# EAGLE design fully_diff_1.7 (EAGLE 7.6.0)
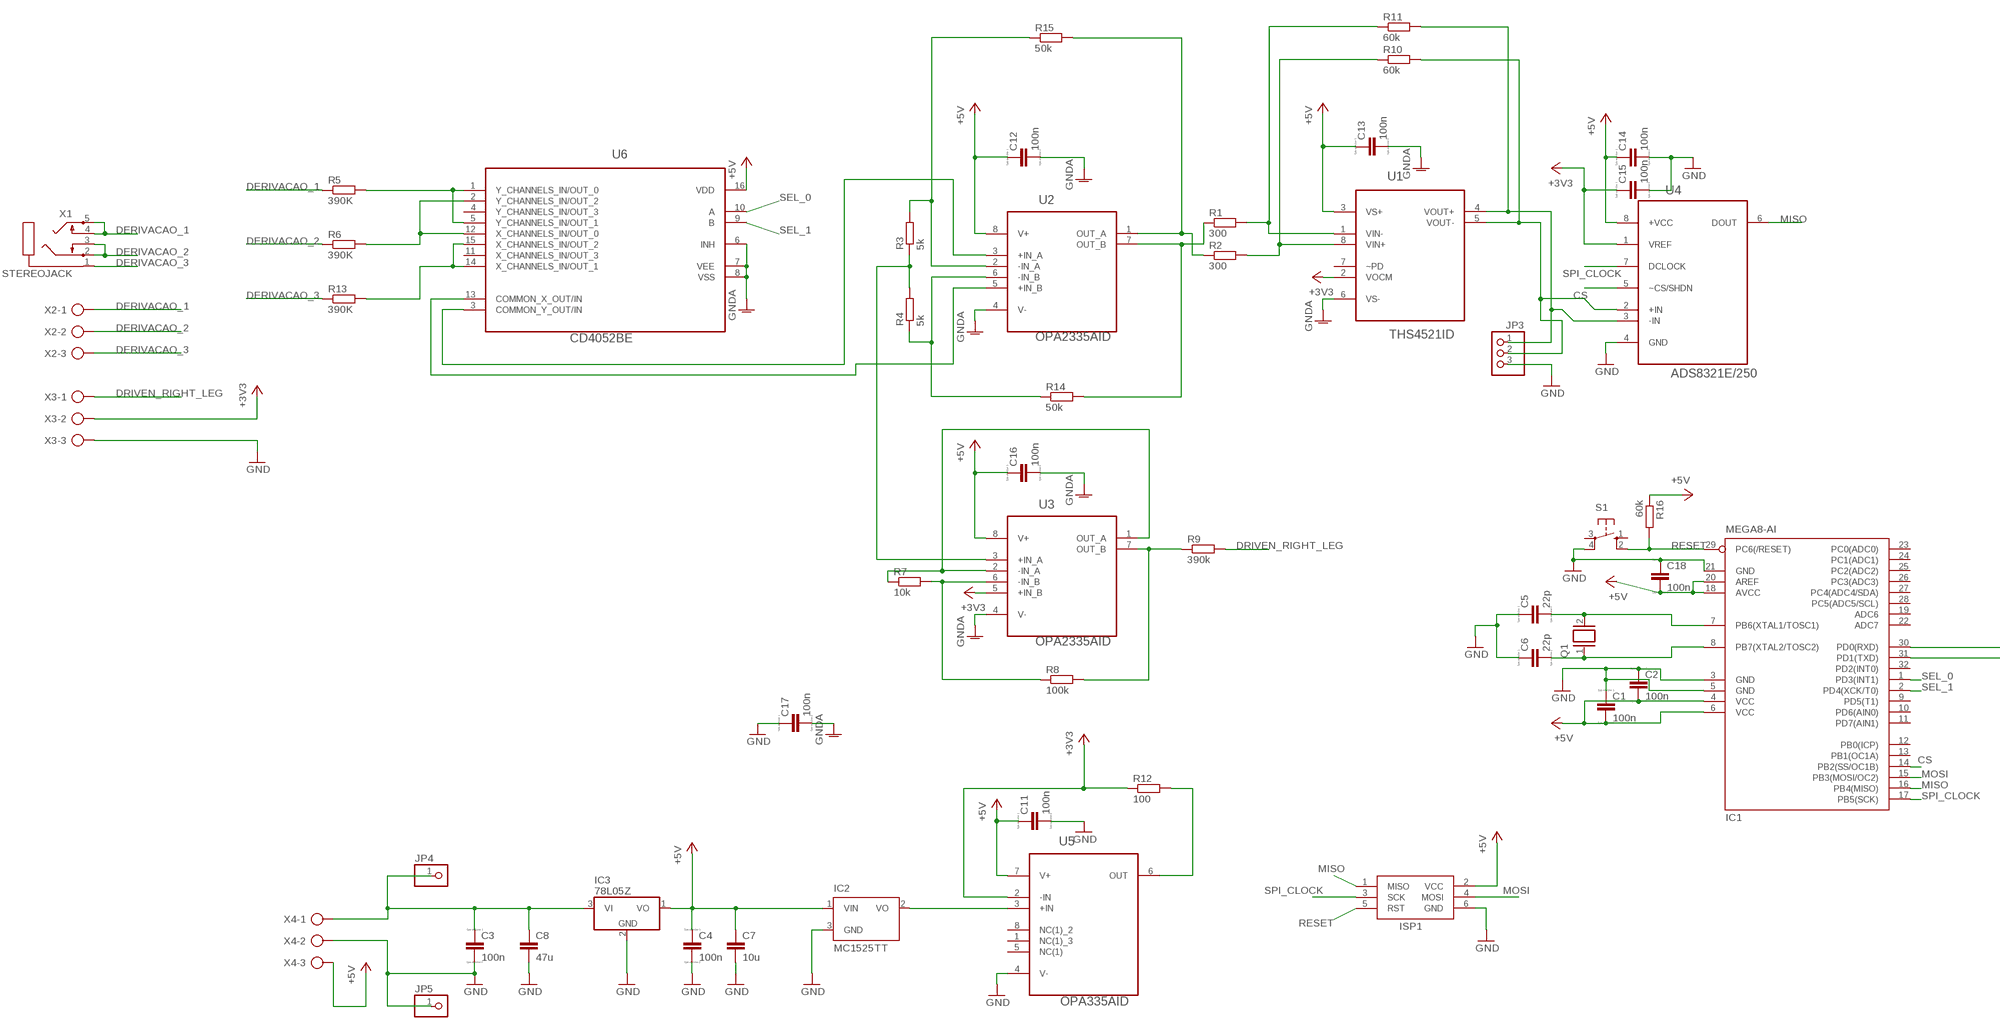
[diagram p0: schematic, sheet 1, part 1 of 2]
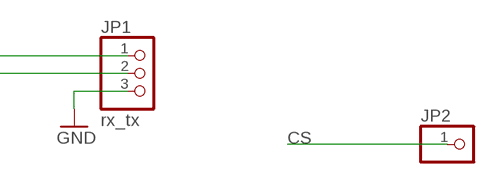
[diagram p1: schematic, sheet 1, part 2 of 2]

## Parts
C1  100n  CC1206  [C1206]
C2  100n  CC1206  [C1206]
C3  100n  CC1206  [C1206]
C4  100n  CC1206  [C1206]
C5  22p  CC1206  [C1206]
C6  22p  CC1206  [C1206]
C7  10u  C-EU025-030X050  [C025-030X050]
C8  47u  C-EU025-030X050  [C025-030X050]
C11  100n  CC1206  [C1206]
C12  100n  CC1206  [C1206]
C13  100n  CC1206  [C1206]
C14  100n  CC1206  [C1206]
C15  100n  CC1206  [C1206]
C16  100n  CC1206  [C1206]
C17  100n  CC1206  [C1206]
C18  100n  CC1206  [C1206]
IC1  MEGA8-AI  [TQFP32-08]
IC2  MC1525TT  [SOT23]
IC3  78L05Z  [TO92]
ISP1  AVRISP-6  [AVRISP]
JP1  rx_tx  PINHD-1X3  [1X03]
JP2  PINHD-1X1  [1X01]
JP3  PINHD-1X3  [1X03]
JP4  PINHD-1X1  [1X01]
JP5  PINHD-1X1  [1X01]
Q1  XTAL/S  [QS]
R1  300  R-EU_R1206  [R1206]
R2  300  R-EU_R1206  [R1206]
R3  5k  R-EU_R1206  [R1206]
R4  5k  R-EU_R1206  [R1206]
R5  390K  R-EU_R1206  [R1206]
R6  390K  R-EU_R1206  [R1206]
R7  10k  R-EU_R1206  [R1206]
R8  100k  R-EU_R1206  [R1206]
R9  390k  R-EU_R1206  [R1206]
R10  60k  R-EU_R1206  [R1206]
R11  60k  R-EU_R1206  [R1206]
R12  100  R-EU_R1206  [R1206]
R13  390K  R-EU_R1206  [R1206]
R14  50k  R-EU_R1206  [R1206]
R15  50k  R-EU_R1206  [R1206]
R16  60k  R-EU_R1206  [R1206]
S1  10-XX  [B3F-10XX]
U1  THS4521ID  [SOIC127P600X175-8N]
U2  OPA2335AID  [SOIC127P600X175-8N]
U3  OPA2335AID  [SOIC127P600X175-8N]
U4  ADS8321E/250  [SOP65P490X110-8N]
U5  OPA335AID  [SOIC127P600X175-8N]
U6  CD4052BE  [DIP254P762X508-16]
X1  STEREOJACK  [STX3100]
X2  AK300/3  [AK300/3]
X3  AK300/3  [AK300/3]
X4  AK300/3  [AK300/3]

## Nets
+3V3: C15.1 R12.1 U1.2(VOCM) U3.5(+IN_B) U4.1(VREF) U5.2(-IN) X3.2
+5V: C1.2 C2.2 C4.1 C7.1 C11.1 C12.1 C13.1 C14.1 C16.1 C18.2 IC1.4(VCC) IC1.6(VCC) IC1.18(AVCC) IC1.20(AREF) IC2.1(VIN) IC3.1(VO) ISP1.2(VCC) R16.1 U1.3(VS+) U2.8(V+) U3.8(V+) U4.8(+VCC) U5.7(V+) U6.16(VDD) X4.3
CS: IC1.14(PB2(SS/OC1B)) JP2.1 U4.5(~CS/SHDN)
DERIVACAO_1: R5.1 X1.4 X1.5 X2.1
DERIVACAO_2: R6.1 X1.2 X1.3 X2.2
DERIVACAO_3: R13.1 X1.1 X2.3
DRIVEN_RIGHT_LEG: R9.2 X3.1
GND: C1.1 C2.1 C3.2 C4.2 C5.1 C6.1 C7.2 C8.2 C11.2 C14.2 C15.2 C17.1 C18.1 IC1.3(GND) IC1.5(GND) IC1.21(GND) IC2.3(GND) IC3.2(GND) ISP1.6(GND) JP1.3 JP3.3 JP5.1 S1.4(P1) U4.4(GND) U5.4(V-) X3.3 X4.2
GNDA: C12.2 C13.2 C16.2 C17.2 U1.6(VS-) U2.4(V-) U3.4(V-) U6.6(INH) U6.7(VEE) U6.8(VSS)
MISO: IC1.16(PB4(MISO)) ISP1.1(MISO) U4.6(DOUT)
MOSI: IC1.15(PB3(MOSI/OC2)) ISP1.4(MOSI)
N$1: R2.2 R10.1 U1.8(VIN+)
N$2: R1.2 R11.1 U1.1(VIN-)
N$3: R1.1 R14.2 U2.7(OUT_B)
N$4: R2.1 R15.2 U2.1(OUT_A)
N$5: R3.2 R15.1 U2.2(-IN_A)
N$6: R4.1 R14.1 U2.6(-IN_B)
N$7: R3.1 R4.2 U3.3(+IN_A)
N$8: R6.2 U6.2(Y_CHANNELS_IN/OUT_2) U6.12(X_CHANNELS_IN/OUT_0)
N$9: R7.1 U3.1(OUT_A) U3.2(-IN_A)
N$10: R8.2 R9.1 U3.7(OUT_B)
N$11: R7.2 R8.1 U3.6(-IN_B)
N$13: JP3.2 R10.2 U1.5(VOUT-) U4.2(+IN)
N$14: JP3.1 R11.2 U1.4(VOUT+) U4.3(-IN)
N$15: C5.2 IC1.7(PB6(XTAL1/TOSC1)) Q1.2
N$16: U2.5(+IN_B) U6.13(COMMON_X_OUT/IN)
N$17: U2.3(+IN_A) U6.3(COMMON_Y_OUT/IN)
N$18: IC2.2(VO) U5.3(+IN)
N$19: C6.2 IC1.8(PB7(XTAL2/TOSC2)) Q1.1
N$20: R5.2 U6.1(Y_CHANNELS_IN/OUT_0) U6.5(Y_CHANNELS_IN/OUT_1)
N$21: R12.2 U5.6(OUT)
N$23: IC1.30(PD0(RXD)) JP1.1
N$24: R13.2 U6.14(X_CHANNELS_IN/OUT_1) U6.15(X_CHANNELS_IN/OUT_2)
N$25: C3.1 C8.1 IC3.3(VI) JP4.1 X4.1
N$26: IC1.31(PD1(TXD)) JP1.2
RESET: IC1.29(PC6(/RESET)) ISP1.5(RST) R16.2 S1.2(S1)
SEL_0: IC1.1(PD3(INT1)) U6.10(A)
SEL_1: IC1.2(PD4(XCK/T0)) U6.9(B)
SPI_CLOCK: IC1.17(PB5(SCK)) ISP1.3(SCK) U4.7(DCLOCK)
Unconnected: IC1.9(PD5(T1)) IC1.10(PD6(AIN0)) IC1.11(PD7(AIN1)) IC1.12(PB0(ICP)) IC1.13(PB1(OC1A)) IC1.19(ADC6) IC1.22(ADC7) IC1.23(PC0(ADC0)) IC1.24(PC1(ADC1)) IC1.25(PC2(ADC2)) IC1.26(PC3(ADC3)) IC1.27(PC4(ADC4/SDA)) IC1.28(PC5(ADC5/SCL)) IC1.32(PD2(INT0)) S1.1(S) S1.3(P) U1.7(~PD) U5.1(NC(1)_3) U5.5(NC(1)) U5.8(NC(1)_2) U6.4(Y_CHANNELS_IN/OUT_3) U6.11(X_CHANNELS_IN/OUT_3)

## Library data of the parts
C1-C6 C11-C18 = eagle-ltspice:C: CAPACITOR, European symbol; SPICEMODEL: NONE; SPICEPREFIX: C
C7 C8 = rcl:C-EU: CAPACITOR, European symbol
IC1 = atmel:MEGA8: MICROCONTROLLER 8 Kbytes FLASH, 1 kbytes SRAM, 512 bytes EEPROM, USART, 6-channel 10 bit ADC, 2-channel 8 bit ADC Pin compatible with Atmega48, ATMega88, ATMega168 Source: avr.lbr; MPN: ATMEGA8-16AU; OC_FARNELL: 9171371; OC_NEWARK: 73M8863
IC2 = microchip:MC15*: 2.5V and 4.096V Voltage References Source: http://www.microchip.com .. 21653b.pdf; OC_FARNELL: unknown; OC_NEWARK: unknown
IC3 = linear:78*: Positive VOLTAGE REGULATOR Source: http://cache.national.com/ds/LM/LM78L05.pdf http://www.fairchildsemi.com/ds/LM/LM7805.pdf
ISP1 = adafruit:AVRISP: AVR ISP HEADER Standard 6 pin header for AVR programming
JP1 JP3 = adafruit:PINHD-1X3: PIN HEADER
JP2 JP4 JP5 = adafruit:PINHD-1X1: Pin header 1x1 for 0.1" spacing With round pins
Q1 = special:XTAL/S: CRYSTAL
R1-R16 = resistor:R-EU_: RESISTOR, European symbol
S1 = switch-omron:10-XX: OMRON SWITCH; MPN: B3F-1000; OC_FARNELL: 176432; OC_NEWARK: 36M3542
U1 = Texas Instruments_By_element14_Batch_1:THS4521ID: VERY LOW POWER, NEGATIVE RAIL INPUT, RAIL-TO-RAIL OUTPUT FULLY DIFFERENTIAL AMPLIFIER; MPN: THS4521ID; OC_FARNELL: 1755707; OC_NEWARK: 45P2938; PACKAGE: SOIC-8; SUPPLIER: Texas Instruments
U2 U3 = Texas Instruments_By_element14_Batch_1:OPA2335AID: CMOS OPERATIONAL AMPLIFIERS; MPN: OPA2335AID; OC_FARNELL: 1470388; OC_NEWARK: 75C4669; PACKAGE: SOIC-8; SUPPLIER: Texas Instruments
U4 = Texas Instruments_By_element14_Batch_1:ADS8321E/250: 16-Bit, High Speed, MicroPower Sampling ANALOG-TO-DIGITAL CONVERTER; MPN: ADS8321E/250; OC_FARNELL: 1470332; OC_NEWARK: 35C1583; PACKAGE: MSOP-8; SUPPLIER: Texas Instruments
U5 = Texas Instruments_By_element14_Batch_1:OPA335AID: CMOS OPERATIONAL AMPLIFIERS; MPN: OPA335AID; OC_FARNELL: 1212296; OC_NEWARK: 75C4833; PACKAGE: SOIC-8; SUPPLIER: Texas Instruments
U6 = Texas Instruments_By_element14_Batch_1:CD4052BE: The CD4052B is a differential 4-Channel multiplexer having two binary control inputs.; MPN: CD4052BE; OC_FARNELL: 9589538; OC_NEWARK: 60K5120; PACKAGE: PDIP-16; SUPPLIER: Texas Instruments
X1 = adafruit:STEREOJACK: MIC/HEADPHONE JACK Stereo jack with two switches. Kycon STX3100, CUI SJ1-3555NG and/or 4UCon 05544
X2-X4 = con-ptr500:AK300/3: CONNECTOR; OC_FARNELL: unknown; OC_NEWARK: unknown

## Board
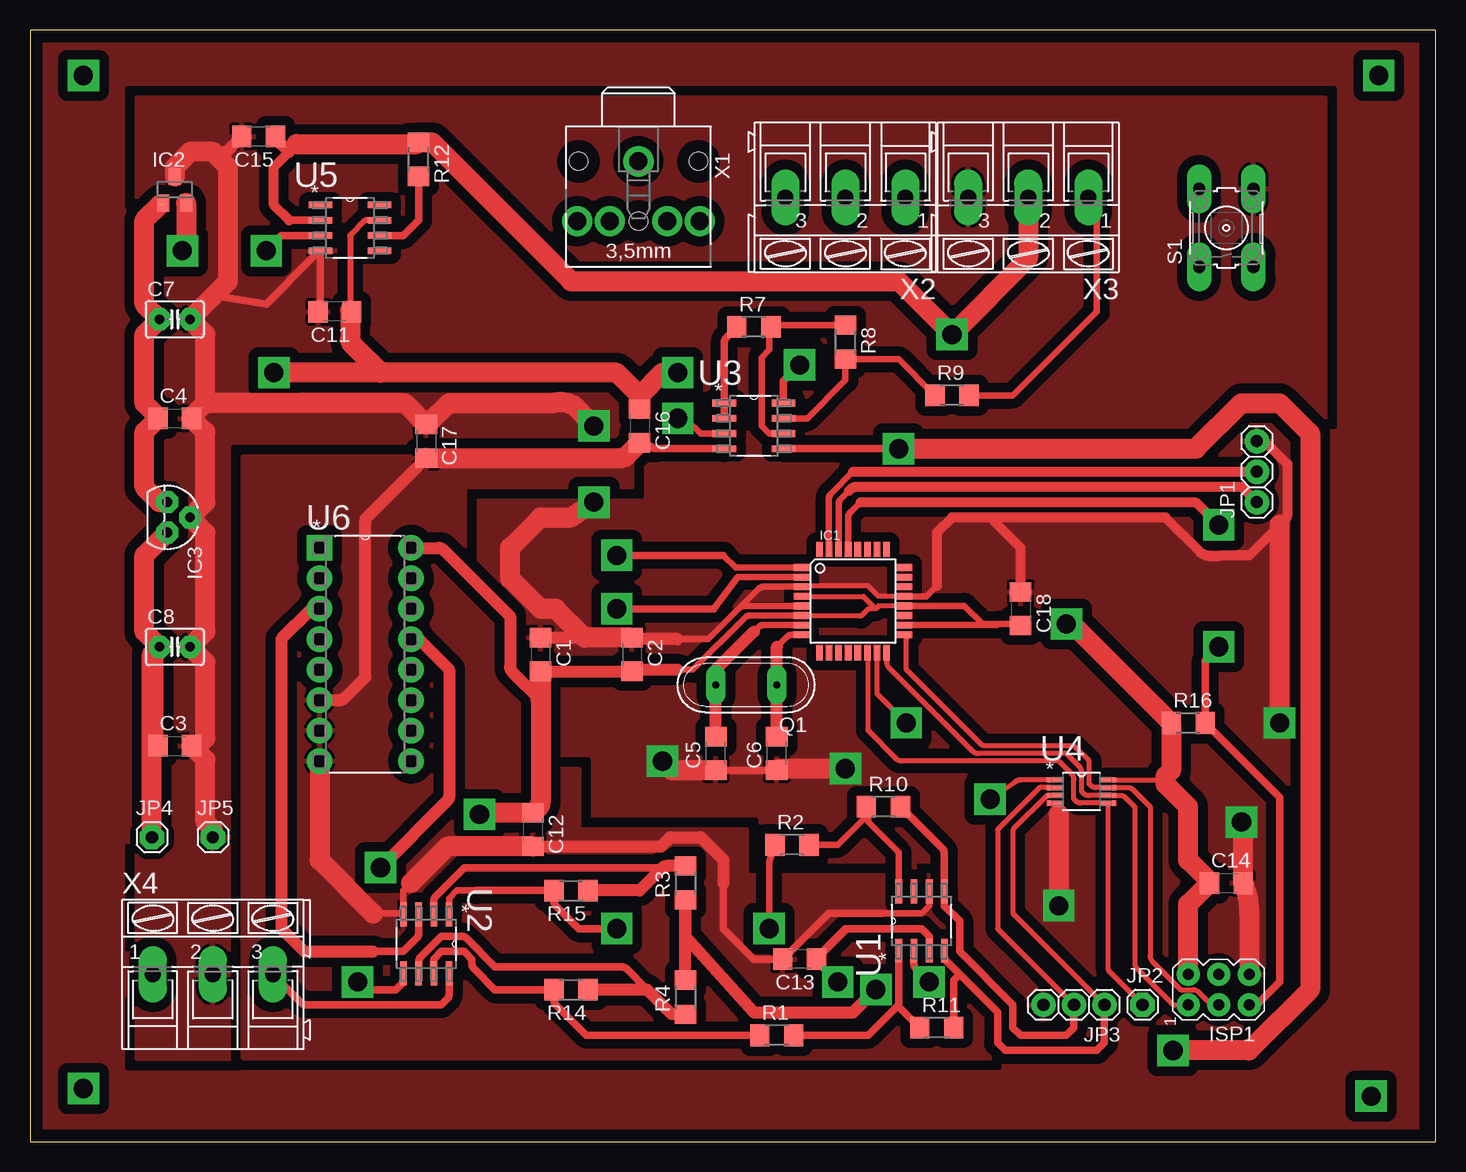
[diagram p2: board, top side]
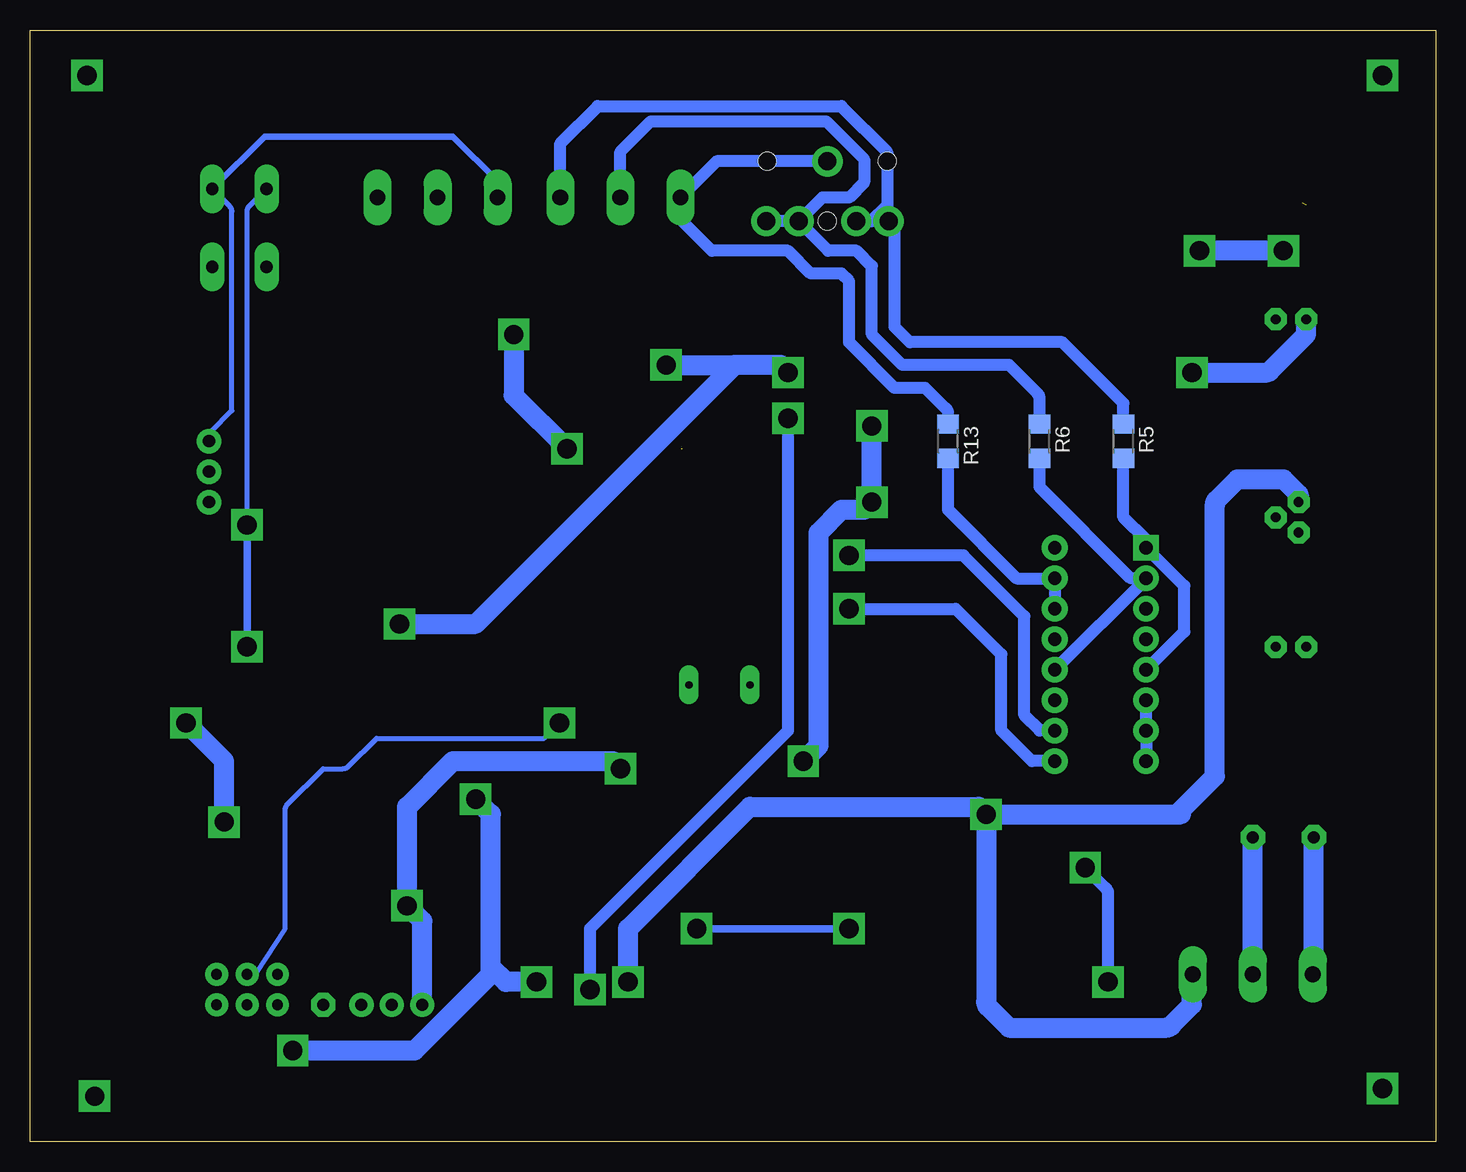
[diagram p3: board, bottom side, seen from below]

Size 117.14 x 92.7 mm. Coordinates in mm from the lower left corner, seen from the top.
Outline: 0,0 117.14,0 117.14,92.7 0,92.7 0,0
Copper layers (1*16): Top 0.035mm / dielectric 1.5mm / Bottom 0.035mm
Design rules "default *": minimum track width 10mil, minimum drill 24mil, track to track 8mil, track to pad 8mil, pad to pad 8mil, via to via 8mil, smd to smd 8mil, copper to edge 40mil, drill to drill 8mil, minimum pad ring 20mil, minimum via ring 20mil, stop-mask expansion 2mil, vias tented up to drill 0mil, thermal gap 10mil

### Footprints (pad centres in the part's own frame; a part is rotated, then mirrored left to right if it is on the bottom)
C1206 = smd 1.6 x 1.8: 1 -1.4,0; 2 1.4,0
C025-030X050 = drill 0.813 octagon: 1 -1.27,0; 2 1.27,0
TQFP32-08 = smd 1.27 x 0.559: 1 -4.293,2.8; 2 -4.293,2; 3 -4.293,1.2; 4 -4.293,0.4; 5 -4.293,-0.4; 6 -4.293,-1.2; 7 -4.293,-2; 8 -4.293,-2.8; 17 4.293,-2.8; 18 4.293,-2; 19 4.293,-1.2; 20 4.293,-0.4; 21 4.293,0.4; 22 4.293,1.2; 23 4.293,2; 24 4.293,2.8 | smd 0.559 x 1.27: 9 -2.8,-4.293; 10 -2,-4.293; 11 -1.2,-4.293; 12 -0.4,-4.293; 13 0.4,-4.293; 14 1.2,-4.293; 15 2,-4.293; 16 2.8,-4.293; 25 2.8,4.293; 26 2,4.293; 27 1.2,4.293; 28 0.4,4.293; 29 -0.4,4.293; 30 -1.2,4.293; 31 -2,4.293; 32 -2.8,4.293
SOT23 = smd 1 x 1.4: 1 -0.95,-1.1; 2 0.95,-1.1; 3 0,1.1
TO92 = drill 0.813 octagon: 1 -1.27,0; 2 0,1.905; 3 1.27,0
AVRISP = drill 0.9 pad 1.626: 1 -1.27,2.54; 2 1.27,2.54; 3 -1.27,0; 4 1.27,0; 5 -1.27,-2.54; 6 1.27,-2.54
1X03 = drill 1.016: 1 -2.54,0; 2 0,0; 3 2.54,0
1X01 = drill 1.016 pad 1.93 octagon: 1 0,0
QS = drill 0.61 long: 1 -2.54,0; 2 2.54,0
R1206 = smd 1.6 x 1.803: 1 -1.422,0; 2 1.422,0
B3F-10XX = drill 1.016 long: 1 -3.251,2.261; 2 3.251,2.261; 3 -3.251,-2.261; 4 3.251,-2.261
SOIC127P600X175-8N = smd 1.981 x 0.559: 1 -2.464,1.905; 2 -2.464,0.635; 3 -2.464,-0.635; 4 -2.464,-1.905; 5 2.464,-1.905; 6 2.464,-0.635; 7 2.464,0.635; 8 2.464,1.905
SOP65P490X110-8N = smd 1.422 x 0.432: 1 -2.184,0.965; 2 -2.184,0.33; 3 -2.184,-0.33; 4 -2.184,-0.965; 5 2.184,-0.965; 6 2.184,-0.33; 7 2.184,0.33; 8 2.184,0.965
DIP254P762X508-16 = drill 1.118 square: 1 -7.62,17.78 | drill 1.118: 2 -7.62,15.24; 3 -7.62,12.7; 4 -7.62,10.16; 5 -7.62,7.62; 6 -7.62,5.08; 7 -7.62,2.54; 8 -7.62,0; 9 0,0; 10 0,2.54; 11 0,5.08; 12 0,7.62; 13 0,10.16; 14 0,12.7; 15 0,15.24; 16 0,17.78
STX3100 = drill 1.5 pad 2.54: 1 2.7,-0.1 | drill 1.5: 2 7.7,5; 3 7.7,2.3; 4 7.7,-2.5; 5 7.7,-5.2 | hole 1.5: 2.7,4.9; 2.7,-5.1; 7.7,-0.1
AK300/3 = drill 1.321 long: 1 -5.004,0; 2 0,0; 3 5.004,0

### Placement (x,y rotation side)
C1  42.55,40.64 270 top
C2  50.16,40.64 270 top
C3  12.06,33.02 0 top
C4  12.06,60.32 0 top
C5  57.15,32.38 90 top
C6  62.23,32.38 90 top
C7  12.06,68.58 0 top
C8  12.06,41.27 0 top
C11  25.4,69.22 180 top
C12  41.91,26.04 270 top
C13  64.13,15.24 180 top
C14  99.69,21.59 0 top
C15  19.05,83.82 180 top
C16  50.8,59.69 270 top
C17  33.02,58.42 270 top
C18  82.55,44.45 270 top
IC1  68.58,45.09 0 top
IC2  12.06,79.38 0 top
IC3  11.43,52.07 270 top
ISP1  99.06,12.7 90 top
JP1  102.23,55.88 90 top
JP2  92.71,11.43 0 top
JP3  86.99,11.43 180 top
JP4  10.16,25.4 0 top
JP5  15.24,25.4 0 top
Q1  59.69,38.1 180 top
R1  62.23,8.89 0 top
R2  63.5,24.77 0 top
R3  54.61,21.59 90 top
R4  54.61,12.07 90 top
R5  26.03,58.42 270 bottom
R6  33.02,58.42 270 bottom
R7  60.33,67.95 0 top
R8  67.94,66.67 270 top
R9  76.83,62.23 0 top
R10  71.12,27.94 0 top
R11  75.56,9.53 0 top
R12  32.38,81.92 270 top
R13  40.64,58.42 270 bottom
R14  45.09,12.7 180 top
R15  45.09,20.96 180 top
R16  96.52,34.92 0 top
S1  99.69,76.2 90 top
U1  74.29,18.41 90 top
U2  33.02,16.51 270 top
U3  60.33,59.69 0 top
U4  87.63,29.21 0 top
U5  26.67,76.2 0 top
U6  31.75,31.75 0 top
X1  50.8,84.45 270 top
X2  67.94,78.74 180 top
X3  83.18,78.74 180 top
X4  15.24,13.97 0 top

### Tracks (layer width: path | path; a pad name or v marks a point on that pad's centre or on a via)
+3V3  (via drill 1.6)  (1 unrouted)
  Top 0.406: U4.1 82.51,30.18 arc45 82.06,29.99 v80.01,28.57
  Top 0.61: 21.59,76.84 U5.2 | U1.2 73.66,14.87 arc45 73.85,14.42 v74.93,13.34 | 31.6,83.19 R12.1 | 62.87,57.78 v72.39,57.78
  Top 0.813: 21.59,76.84 20.32,78.11 20.32,81.28 21.59,82.55 22.23,83.19
  Top 1.016: C15.1 20.45,83.69 21.59,82.55
  Top 1.676: v72.39,57.78 97.16,57.78 100.96,61.59 104.14,61.59 106.68,59.05 106.68,12.7 101.6,7.62 v95.25,7.62 | 22.23,83.19 32.23,83.19 R12.1 33.5,83.34 45.09,71.76 72.39,71.76 v76.83,67.31 83.18,73.66 X3.2
  Bottom 0.61: 77.66,13.52 78.74,14.61 78.74,27.04 arc-45 78.93,27.49 v80.01,28.57
  Bottom 1.676: v95.25,7.62 85.09,7.62 78.74,13.97 78.74,14.61 | 78.74,14.61 78.74,27.3 v80.01,28.57 | v74.93,13.34 77.47,13.34 78.74,14.61 | v76.83,67.31 76.83,62.23 v72.39,57.78
+5V  (via drill 1.6, 1.6 pad 0.25)  (1 unrouted)
  Top 0.406: C1.2 C2.2 50.3,39.37 53.98,39.37 | IC1.4 69.45,45.48 70.48,44.45 | IC1.6 69.14,43.88 69.22,43.81 69.85,44.45 70.48,44.45 | IC1.20 70.72,44.68 70.48,44.45 | U4.8 94.31,30.18 94.61,30.48
  Top 0.508: U5.7 27.94,76.84 26.67,75.56 26.67,69.34 C11.1
  Top 0.559: IC1.6 60.02,43.88 arc45 59.57,43.7 55.25,39.37 53.98,39.37 | 74.29,17.78 70.48,17.78 | 86.49,43.05 v86.36,43.18 | IC1.20 77.87,44.68 79.38,43.18 80.64,43.18 | 80.64,43.18 82.42,43.18 C18.2 | IC1.18 80.55,43.09 80.64,43.18
  Top 0.61: U2.8 34.92,12.33 arc-45 34.74,11.88 34.29,11.43 23.05,11.43 arc-45 22.6,11.62 X4.3 | 82.52,43.09 C18.2 | U3.8 62.79,63.42 v64.13,64.77 | v53.98,64.14 53.98,63.63 | 70.48,17.78 68.08,17.78 C13.1 | U1.3 74.93,17.14 74.29,17.78 67.94,17.78 65.41,15.24 v67.31,13.34
  Top 1.016: C1.2 50.04,39.24 50.16,39.37 53.98,39.37 | U6.16 34.03,49.53 arc-45 34.48,49.34 40.01,43.81 40.01,39.63 arc45 40.19,39.18 42.55,36.83
  Top 1.676: IC3.1 10.79,53.34 9.52,54.61 9.52,59.18 C4.1 10.66,60.45 9.52,61.59 9.52,67.31 C7.1 9.52,69.85 9.52,76.84 10.79,78.11 | C1.2 42.55,36.83 42.55,28.33 arc-45 42.36,27.88 C12.1 38.49,27.44 arc45 38.04,27.25 v37.46,27.3 | 29.21,64.14 48.9,64.14 50.61,62.42 arc-45 50.8,61.97 C16.1 50.8,62.23 52.7,64.14 v53.98,64.14 | 29.21,64.14 v20.32,64.14 | 26.67,69.34 26.67,66.94 arc45 26.86,66.49 29.21,64.14 | ISP1.2 96.52,19.82 C14.1 98.29,21.72 96.52,23.5 96.52,27.94 94.61,29.85 94.61,30.48 95.1,30.96 R16.1 86.97,43.05 86.49,43.05
  Bottom 0.61: 54.61,64.77 v53.98,64.14
  Bottom 1.676: v37.46,27.3 21.22,27.3 arc-45 21.4,27.49 18.41,30.48 18.41,53.08 arc45 18.23,53.53 16.51,55.24 12.7,55.24 11.43,53.97 IC3.1 | v37.46,27.3 37.46,11.69 arc-45 37.28,11.24 35.56,9.53 22.49,9.53 arc-45 22.04,9.71 20.32,11.43 20.32,13.79 arc45 X4.3 | v20.32,64.14 14.23,64.14 arc-45 13.78,64.32 10.79,67.31 C7.1 | v67.31,13.34 67.31,17.78 57.15,27.94 38.1,27.94 v37.46,27.3 | v86.36,43.18 80.01,43.18 58.42,64.77 | 54.61,64.77 58.42,64.77 | v64.13,64.77 58.42,64.77
CS
  Top 0.406: JP2.1 90,14.14 arc-45 89.81,14.59 U4.5 87.59,28.25 arc-45 87.14,28.43 86.99,28.57 86.99,30.22 arc45 86.81,30.67 85.72,31.75 72.65,31.75 arc-45 72.2,31.94 69.85,34.29 69.85,40.62 | 69.85,40.62 arc45 IC1.14 arc-45 69.85,40.62
DERIVACAO_1
  Bottom 1.016: X2.1 72.95,83.26 69.85,86.36 49.53,86.36 45.72,82.55 45.72,78.11 | 45.72,78.11 45.72,76.88 X1.5 45.09,76.24 45.09,67.95 43.82,66.67 31.12,66.67 26.03,61.59 R5.1 | X1.4 47.07,76.76 45.72,78.11
DERIVACAO_2
  Bottom 1.016: X2.2 67.94,82.55 65.41,85.09 50.8,85.09 47.62,81.92 47.62,80.01 48.9,78.74 51.12,78.74 X1.3 | X1.3 X1.2 | X1.3 50.64,74.3 48.26,74.3 46.99,73.03 46.99,67.31 44.45,64.77 35.56,64.77 33.21,62.42 arc45 33.02,61.97 R6.1
DERIVACAO_3
  Bottom 1.016: X1.1 59.93,81.76 X2.3 62.87,78.66 62.87,76.84 60.33,74.3 53.98,74.3 52.07,72.39 49.53,72.39 48.9,71.76 48.9,66.67 45.09,62.86 42.55,62.86 40.83,61.15 arc45 40.64,60.7 R13.1
DRIVEN_RIGHT_LEG
  Top 0.559: R9.2 81.91,62.23 88.9,69.22 88.9,78.03 X3.1
GND  (via drill 1.6)
  Top 0.406: 50.04,42.04 C2.1 50.3,41.91 | IC1.21 70.72,45.48 69.85,46.35 64.36,46.35 IC1.3 | 85.72,27.3 85.72,27.96 U4.4
  Top 0.508: 15.88,70.48 15.88,71.12 16.19,71.44
  Top 0.559: 53.98,41.91 56.52,41.91 59.1,44.5 | IC1.5 59.55,44.68 arc45 59.1,44.5 | IC1.3 61.15,46.28 arc45 60.7,46.1 59.1,44.5 | IC1.21 74.69,45.48 75.56,46.35
  Top 0.61: C11.2 24.21,69.64 U5.4 23.49,73.66 19.69,69.85 15.88,70.48 | C6.1 C5.1
  Top 0.813: JP1.3 102.61,58.42 arc-45 103.06,58.23 104.77,56.52 104.77,52.33 arc-45 104.59,51.88 104.14,51.43 101.6,48.89 99.32,48.89 arc-45 97.6,49.08 94.61,52.07 80.01,52.07 | C18.1 82.55,49.53 80.01,52.07 | 80.01,52.07 76.83,52.07 75.56,50.8 75.56,46.35
  Top 1.016: C1.1 50.04,42.04 50.16,41.91 | 53.98,41.91 50.48,41.91 arc-45 C2.1 | 15.24,82.55 16.38,82.55 C15.2
  Top 1.676: JP5.1 15.24,26.04 14.61,26.67 14.61,31.88 C3.2 13.97,33.02 14.61,33.66 14.61,40 C8.2 14.61,42.54 14.61,50.8 IC3.2 14.61,53.34 14.61,59.18 C4.2 13.46,60.45 14.42,61.41 | 14.42,61.41 14.61,61.59 14.61,67.31 C7.2 16.19,71.44 16.51,71.76 16.51,81.28 15.24,82.55 13.34,82.55 12.06,81.28 IC2.3 | 14.42,61.41 arc-45 14.87,61.59 30.98,61.59 arc-45 31.43,61.41 C17.1 arc45 33.24,59.91 34.92,61.59 43.55,61.59 arc-45 45.27,61.41 v46.99,59.69 | 50.04,42.04 46.23,42.04 43.82,44.45 42.55,44.45 40.01,46.99 40.01,49.53 42.55,52.07 45.09,52.07 v46.99,53.34 | ISP1.6 101.6,19.05 101.47,20.45 C14.2 101.09,26.54 v100.96,26.67 | v104.14,34.92 104.14,51.43 | C5.1 53.47,30.98 v52.7,31.75 | 85.72,27.3 v85.72,19.68 | v67.94,31.12 62.36,31.12 C6.1
  Bottom 0.406: JP1.3 102.23,58.79 arc45 102.05,59.24 100.33,60.96 100.33,77.56 arc-45 100.52,78.01 S1.4
  Bottom 0.559: X3.3 78.18,80.09 81.91,83.82 97.59,83.82 S1.4
  Bottom 1.676: X4.2 JP5.1 | v46.99,59.69 v46.99,53.34 47.62,52.7 49.53,52.7 51.44,50.8 51.44,33.02 v52.7,31.75 | JP3.3 84.45,18.41 v85.72,19.68 85.72,27.94 81.91,31.75 68.58,31.75 v67.94,31.12 | v100.96,26.67 100.96,31.75 v104.14,34.92
  pour Top (isolate 0.813, rank 2): 9.52,6.99 107.95,6.99 107.95,87 8.89,87 8.89,6.99
GNDA
  Top 0.559: U1.6 74.93,19.68 74.29,19.05 71.12,19.05 | 28.58,19.05 31.04,19.05 U2.4 31.12,20.96 32.38,22.23
  Top 0.61: U3.4 52.2,57.78 arc-45 51.75,57.97 C16.2 | 71.12,19.05 66.55,19.05 C13.2 60.33,15.24 57.79,17.78 57.79,21.59
  Top 1.016: U6.6 25.77,36.83 arc45 26.22,37.02 27.94,38.73 27.94,51.68 arc-45 28.13,52.13 C17.2 | C12.2 52.58,24.64 53.34,25.4 55.88,25.4 57.79,23.5 57.79,21.59
  Top 1.676: C17.2 49.27,57.02 arc45 49.72,57.21 C16.2 | U6.8 24.13,23.5 28.58,19.05 | C12.2 34.8,24.64 32.38,22.23 31.75,21.59
  Bottom 1.016: U6.8 U6.7 U6.6
  pour Top (isolate 0.813): 17.78,57.15 50.16,57.15 50.16,54.61 36.2,54.61 36.2,31.12 45.72,31.12 45.72,30.48 45.72,26.04 59.05,26.04 59.69,26.04 59.69,22.23 78.1,22.23 78.1,21.59 80.01,21.59 80.01,6.99 17.78,6.99
MISO
  Top 0.406: ISP1.1 95.25,11.43 92.26,14.42 arc-45 92.07,14.87 92.07,27.94 91.32,28.69 arc45 90.87,28.88 U4.6 88.22,28.88 arc-45 87.77,29.07 87.63,29.21 87.63,30.85 arc45 87.44,31.3 86.36,32.38 79,32.38 arc-45 78.55,32.57 71.57,39.56 arc-45 71.38,40.01 IC1.16
MOSI  (via drill 1.6)
  Top 0.406: IC1.15 70.58,37.37 v73.02,34.92
  Bottom 0.406: ISP1.4 98.69,13.97 arc-45 98.24,14.16 95.88,17.78 95.88,27.68 arc45 95.7,28.13 92.71,31.12 91.07,31.12 arc-45 90.62,31.3 88.27,33.66 74.29,33.66 v73.02,34.92
N$1
  Top 0.559: U1.8 72.39,24.13 69.85,26.67 69.85,27.3 | 69.85,27.3 69.85,27.79 R10.1 | R2.2 67.31,24.77 69.85,27.3
N$2
  Top 0.61: U1.1 72.39,11.43 | 72.39,11.43 72.39,11.28 R11.1 | R1.2 69.85,8.89 72.39,11.43
N$3
  Top 0.61: U2.7 33.66,15.24 34.29,15.88 36.2,15.88 36.83,15.24 36.83,14.87 arc45 37.02,14.42 38.73,12.7 R14.2 43.66,11.84 arc45 43.85,11.4 46.36,8.89 R1.1
N$4  (via drill 1.6)
  Top 0.559: v61.59,17.78 61.59,23.34 R2.1 | 37.17,20.96 35.56,20.96 34.92,20.32 U2.1
  Top 0.61: 37.17,20.96 R15.2 43.66,20.05 arc45 43.82,19.68 45.72,17.78 v48.9,17.78
  Bottom 0.61: v48.9,17.78 v61.59,17.78
N$5
  Top 0.61: U2.2 33.66,20.06 arc-45 33.84,20.51 36.2,22.86 52.59,22.86 arc-45 52.67,22.83
  Top 1.016: R3.2 53.12,23.01 arc45 52.67,22.83 50.8,20.96 R15.1
N$6
  Top 0.61: U2.6 32.38,14.98 arc-45 32.57,15.43 34.29,17.14 35.93,17.14 arc-45 36.38,16.96 38.73,14.61 49.27,14.61 arc-45 49.72,14.42 51.44,12.7
  Top 1.016: R4.1 53.49,10.64 51.44,12.7 R14.1
N$7  (via drill 1.6)
  Top 0.559: U3.3 55.88,59.05 54.61,60.32 v53.98,60.32
  Top 1.016: R4.2 R3.1 54.61,17.14 60.33,10.79 68.58,10.79 v70.48,12.7
  Bottom 1.016: v53.98,60.32 53.98,34.29 70.48,17.78 v70.48,12.7
N$8
  Bottom 1.016: U6.12 U6.2 25.4,46.99 33.02,54.61 R6.2
N$9
  Top 0.61: U3.2 U3.1 57.86,66.64 arc-45 58.05,67.09 R7.1
N$10
  Top 0.559: U3.7 64.77,60.32 67.94,63.5 R8.2 72.39,65.25 R9.1
N$11
  Top 0.559: U3.6 61.59,59.05 60.96,59.69 60.96,65.41 61.59,66.04 61.59,67.79 R7.2 61.9,68.1 R8.1
N$12
  pour Top (isolate 0.813, rank 3): 0.63,92.08 115.57,92.08 115.57,0.63 0.63,0.63
N$13
  Top 0.406: U4.2 84.15,29.54 80.64,26.04 80.64,17.78 JP3.2
  Top 0.61: R10.2 76.01,24.47 arc-45 76.2,24.02 U1.5 76.2,19.68 77.47,18.41 77.47,15.88 81.91,11.43 81.91,9.53 82.55,8.89 86.36,8.89 86.99,9.53 JP3.2
  Top 1.016: 72.52,27.99 arc45 R10.2
N$14
  Top 0.406: U4.3 84.76,28.88 81.91,26.04 81.91,19.05 JP3.1
  Top 0.61: U1.4 76.2,15.5 arc45 76.39,15.05 77.47,13.97 | R11.2 76.99,13.49 77.47,13.97 | 77.47,13.97 80.64,10.79 80.64,8.26 81.28,7.62 88.9,7.62 89.53,8.26 JP3.1
N$15
  Top 0.559: IC1.7 61.13,43.09 arc45 60.68,42.9 60.33,42.54
  Top 1.016: C5.2 Q1.2 57.15,39.37 60.33,42.54
N$16  (via drill 1.6 pad 0.25)
  Top 0.61: U2.5 31.12,13.6 arc-45 30.93,13.15 30.48,12.7 27.94,12.7 v27.3,13.34
  Top 1.016: U6.13 32.38,41.91 34.92,39.37 34.92,28.84 arc-45 34.74,28.39 v29.21,22.86
  Bottom 1.016: v27.3,13.34 27.3,20.69 arc-45 27.49,21.14 v29.21,22.86
N$17
  Top 0.61: U2.3 32.38,17.41 arc-45 32.2,16.96 31.12,15.88 28.58,15.88
  Top 1.016: U6.3 23.49,44.45 20.95,41.91 20.95,18.04 arc45 21.14,17.59 22.86,15.88 28.58,15.88
N$18  (via drill 1.6)
  Top 0.61: U5.3 20.95,75.56 v19.69,74.3
  Top 1.676: IC2.2 13.02,74.61 v12.7,74.3
  Bottom 1.676: v12.7,74.3 v19.69,74.3
N$19
  Top 0.559: IC1.8 63.5,42.28 arc45 63.05,42.1 62.23,41.27
  Top 1.016: C6.2 Q1.1 62.23,41.27
N$20
  Bottom 1.016: U6.5 20.95,42.54 20.95,46.35 U6.1 24.13,50.16 26.03,52.07 R5.2
N$21
  Top 0.61: U5.6 31.12,75.56 32.38,76.84 R12.2
N$22  (via drill 1.6)
  other vias: 4.44,88.9
N$23
  Top 0.406: 68.26,54.29 68.58,54.61
  Top 0.559: IC1.30 67.38,53.15 arc-45 67.57,53.6 68.26,54.29
  Top 0.813: JP1.1 100.96,54.61 68.84,54.61 arc45 68.39,54.42 68.26,54.29
N$24
  Bottom 1.016: U6.14 U6.15 34.92,46.99 40.64,52.7 R13.2
N$25
  Top 1.016: C3.1 10.66,41.14 C8.1
  Top 1.676: JP4.1 10.16,40.64 C8.1 9.52,42.54 9.52,48.89 IC3.3
  Bottom 1.676: X4.1 10.16,13.97 JP4.1
N$26
  Top 0.559: IC1.31 66.58,53.62 arc-45 66.77,54.07 68.58,55.88
  Top 0.813: 68.58,55.88 JP1.2
N$27  (via drill 1.6)
  other vias: 112.39,88.9
N$28  (via drill 1.6)
  other vias: 4.44,4.45
N$29  (via drill 1.6)
  other vias: 111.76,3.81
RESET  (via drill 1.6, 1.6 pad 0.25)
  Top 0.559: IC1.29 68.18,52.04 arc-45 68.37,52.49 69.22,53.34
  Top 0.61: ISP1.5 102.23,11.43 104.14,13.34 104.14,28.73 R16.2 97.94,40.16 v99.06,41.27
  Top 0.813: 69.22,53.34 96.89,53.34 arc-45 97.34,53.15 v99.06,51.43
  Bottom 0.406: v99.06,51.43 99.06,77.56 arc45 98.87,78.01 S1.2
  Bottom 0.61: v99.06,41.27 v99.06,51.43
SEL_0  (via drill 1.6)
  Top 0.559: IC1.1 58.8,47.88 57.79,48.89
  Top 0.61: 57.79,48.89 v48.9,48.89
  Bottom 1.016: U6.10 33.02,34.29 34.29,35.56 34.29,43.81 39.37,48.89 v48.9,48.89
SEL_1  (via drill 1.6)
  Top 0.559: IC1.2 58.96,47.09 56.96,44.45
  Top 0.61: v48.9,44.45 56.96,44.45
  Bottom 1.016: U6.9 33.66,31.75 36.2,34.29 36.2,40.64 40.01,44.45 v48.9,44.45
SPI_CLOCK
  Top 0.406: ISP1.3 98.42,11.43 97.34,12.51 arc45 96.89,12.7 95.88,12.7 93.53,15.05 arc-45 93.34,15.5 93.34,27.94 91.93,29.35 arc45 91.48,29.54 U4.7 88.83,29.54 arc-45 88.38,29.73 88.27,29.85 88.27,31.75 86.99,33.02 79.64,33.02 arc-45 79.19,33.21 73.02,39.37 73.02,41.92 arc45 IC1.17